# EAGLE design pwmMeterClock (EAGLE 5.10)
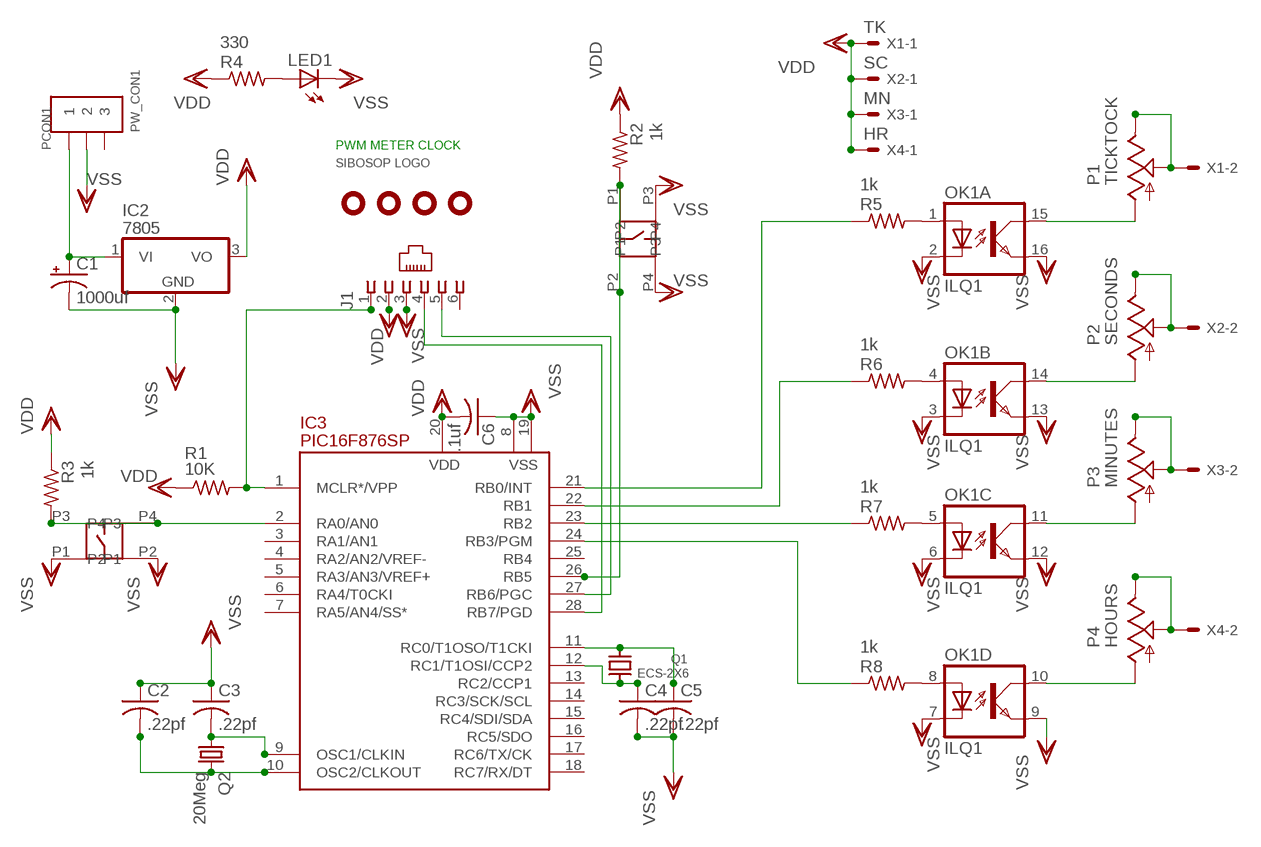
[diagram p0: schematic, sheet 1]

## Parts
C1  1000uf  CPOL-USE3.5-10  [E3,5-10]
C2  .22pf  C-US025-024X044  [C025-024X044]
C3  .22pf  C-US025-024X044  [C025-024X044]
C4  .22pf  C-US025-024X044  [C025-024X044]
C5  .22pf  C-US025-024X044  [C025-024X044]
C6  .1uf  C-US025-024X044  [C025-024X044]
IC2  7805  [TO220V]
IC3  PIC16F876SP  [DIL28-3]
J1  520250-3  [520250-3]
LED1  LEDSQR2X5  [LED2X5]
OK1  ILQ1  [DIL16]
P1  TICKTOCK  TRIMPOT  [RJ6S]
P2  SECONDS  TRIMPOT  [RJ6S]
P3  MINUTES  TRIMPOT  [RJ6S]
P4  HOURS  TRIMPOT  [RJ6S]
PCON1  PW_CON1  [PW_CON1]
Q1  ECS-2X6  [RADIAL-CRYSTAL-2.1MM]
Q2  20Meg  CRYSTALHC49S  [HC49/S]
R1  10K  R-US_0204/2V  [0204V]
R2  1k  R-US_0204/2V  [0204V]
R3  1k  R-US_0204/2V  [0204V]
R4  330  R-US_0204/2V  [0204V]
R5  1k  R-US_0204/2V  [0204V]
R6  1k  R-US_0204/2V  [0204V]
R7  1k  R-US_0204/2V  [0204V]
R8  1k  R-US_0204/2V  [0204V]
SW1  Hour  SW-B3W-1052  [SW-B3W-1052]
SW2  SW-B3W-1052  [SW-B3W-1052]
U$1  HOLE-125  [HOLE-125]
U$2  HOLE-125  [HOLE-125]
U$3  LOGO  [LOGO]
U$5  HOLE-125  [HOLE-125]
U$6  HOLE-125  [HOLE-125]
X1  TK  22-23-2021  [22-23-2021]
X2  SC  22-23-2021  [22-23-2021]
X3  MN  22-23-2021  [22-23-2021]
X4  HR  22-23-2021  [22-23-2021]

## Nets
N$1: IC3.1(MCLR*/VPP) J1.1 R1.2
N$2: C1.+ IC2.1(VI) PCON1.P$1
N$3: C2.2 IC3.10(OSC2/CLKOUT) Q2.2
N$4: C3.2 IC3.9(OSC1/CLKIN) Q2.1
N$5: P1.E P1.S X1.2
N$6: C5.1 IC3.11(RC0/T1OSO/T1CKI) Q1.1
N$7: C4.1 IC3.12(RC1/T1OSI/CCP2) Q1.2
N$8: P2.E P2.S X2.2
N$9: P3.E P3.S X3.2
N$10: P4.E P4.S X4.2
N$11: OK1.15(A:COL) P1.A
N$12: IC3.2(RA0/AN0) R3.2 SW1.P3 SW1.P4
N$13: IC3.26(RB5) R2.2 SW2.P1 SW2.P2
N$14: IC3.27(RB6/PGC) J1.5
N$15: OK1.14(B:COL) P2.A
N$16: OK1.11(C:COL) P3.A
N$17: OK1.10(D:COL) P4.A
N$18: IC3.28(RB7/PGD) J1.4
N$19: OK1.1(A:A) R5.2
N$20: OK1.4(B:A) R6.2
N$21: OK1.5(C:A) R7.2
N$22: LED1.A R4.2
N$23: OK1.8(D:A) R8.2
N$24: IC3.21(RB0/INT) R5.1
N$25: IC3.22(RB1) R6.1
N$26: IC3.23(RB2) R7.1
N$27: IC3.24(RB3/PGM) R8.1
VDD: C6.2 IC2.3(VO) IC3.20(VDD) J1.2 R1.1 R2.1 R3.1 R4.1 X1.1 X2.1 X3.1 X4.1
VSS: C1.- C2.1 C3.1 C4.2 C5.2 C6.1 IC2.2(GND) IC3.8(VSS) IC3.19(VSS) J1.3 LED1.K(C) OK1.2(A:C) OK1.3(B:C) OK1.6(C:C) OK1.7(D:C) OK1.9(D:EMIT) OK1.12(C:EMIT) OK1.13(B:EMIT) OK1.16(A:EMIT) PCON1.P$2 SW1.P1 SW1.P2 SW2.P3 SW2.P4
Unconnected: IC3.3(RA1/AN1) IC3.4(RA2/AN2/VREF-) IC3.5(RA3/AN3/VREF+) IC3.6(RA4/T0CKI) IC3.7(RA5/AN4/SS*) IC3.13(RC2/CCP1) IC3.14(RC3/SCK/SCL) IC3.15(RC4/SDI/SDA) IC3.16(RC5/SDO) IC3.17(RC6/TX/CK) IC3.18(RC7/RX/DT) IC3.25(RB4) J1.6 PCON1.P$3

## Notes on the sheet
- PWM METER CLOCK

## Library data of the parts
C1 = rcl:CPOL-US: POLARIZED CAPACITOR, American symbol
C2-C6 = rcl:C-US: CAPACITOR, American symbol
IC2 = kmarx1:78*: 78xx Family - Positive voltage regulator
IC3 = pic16f87x:PIC16F876: FLASH MICROCONTROLLER
J1 = con-amp:520250-3: AMP connector
LED1 = led:LED: LED OSRAM: - CHIPLED LG R971, LG N971, LY N971, LG Q971, LY Q971, LO R971, LY R971 LH N974, LH R974 LS Q976, LO Q976, LY Q976 LO Q996 - Hyper CHIPLED LW Q18S LB Q993, LB Q99A, LB R99A - SideLED LS A670, LO A670, LY A670, LG A670, LP A670 LB A673, LV A673, LT A673, LW A673 LH A674 LY A675 LS A676, LA A676, LO A676, LY A676, LW A676 LS A679, LY A679, LG A679 - Hyper Micro SIDELED® LS Y876, LA Y876, LO Y876, LY Y876 LT Y87S - SmartLED LW L88C, LW L88S LB L89C, LB L89S, LG L890 LS L89K, LO L89K, LY L89K LS L896, LA L896, LO L896, LY L896 - TOPLED LS T670, LO T670, LY T670, LG T670, LP T670 LSG T670, LSP T670, LSY T670, LOP T670, LYG T670 LG T671, LOG T671, LSG T671 LB T673, LV T673, LT T673, LW T673 LH T674 LS T676, LA T676, LO T676, LY T676, LB T676, LH T676, LSB T676, LW T676 LB T67C, LV T67C, LT T67C, LS T67K, LO T67K, LY T67K, LW E67C LS E67B, LA E67B, LO E67B, LY E67B, LB E67C, LV E67C, LT E67C LW T67C LS T679, LY T679, LG T679 LS T770, LO T770, LY T770, LG T770, LP T770 LB T773, LV T773, LT T773, LW T773 LH T774 LS E675, LA E675, LY E675, LS T675 LS T776, LA T776, LO T776, LY T776, LB T776 LHGB T686 LT T68C, LB T68C - Hyper Mini TOPLED® LB M676 - Mini TOPLED Santana® LG M470 LS M47K, LO M47K, LY M47K Source: http://www.osram.convergy.de LUXEON: - LUMILED® LXK2-PW12-R00, LXK2-PW12-S00, LXK2-PW14-U00, LXK2-PW14-V00 LXK2-PM12-R00, LXK2-PM12-S00, LXK2-PM14-U00 LXK2-PE12-Q00, LXK2-PE12-R00, LXK2-PE12-S00, LXK2-PE14-T00, LXK2-PE14-U00 LXK2-PB12-K00, LXK2-PB12-L00, LXK2-PB12-M00, LXK2-PB14-N00, LXK2-PB14-P00, LXK2-PB14-Q00 LXK2-PR12-L00, LXK2-PR12-M00, LXK2-PR14-Q00, LXK2-PR14-R00 LXK2-PD12-Q00, LXK2-PD12-R00, LXK2-PD12-S00 LXK2-PH12-R00, LXK2-PH12-S00 LXK2-PL12-P00, LXK2-PL12-Q00, LXK2-PL12-R00 Source: www.luxeon.com KINGBRIGHT: KA-3528ASYC Source: www.kingbright.com
OK1 = optocoupler:ILQ1: SIEMENS OPTO COUPLER
P1-P4 = sibosop:TRIMPOT
PCON1 = powerconnectorskt:PW_CON1
Q1 = kmarx1:ECS-2X6: ECS 2x6 32khz Tuning Fork Crystal ECS-.327-12.5-13 digikey X802-ND
Q2 = crystal:CRYSTAL: CRYSTAL
R1-R8 = rcl:R-US_: RESISTOR, American symbol
SW1 SW2 = sibosop:SW-B3W-1052
U$1 U$2 U$5 U$6 = sibosop:HOLE-125
U$3 = sibosop:LOGO
X1-X4 = sibosop-con-molex:22-23-2021: .100" (2.54mm) Center Header - 2 Pin

## Board
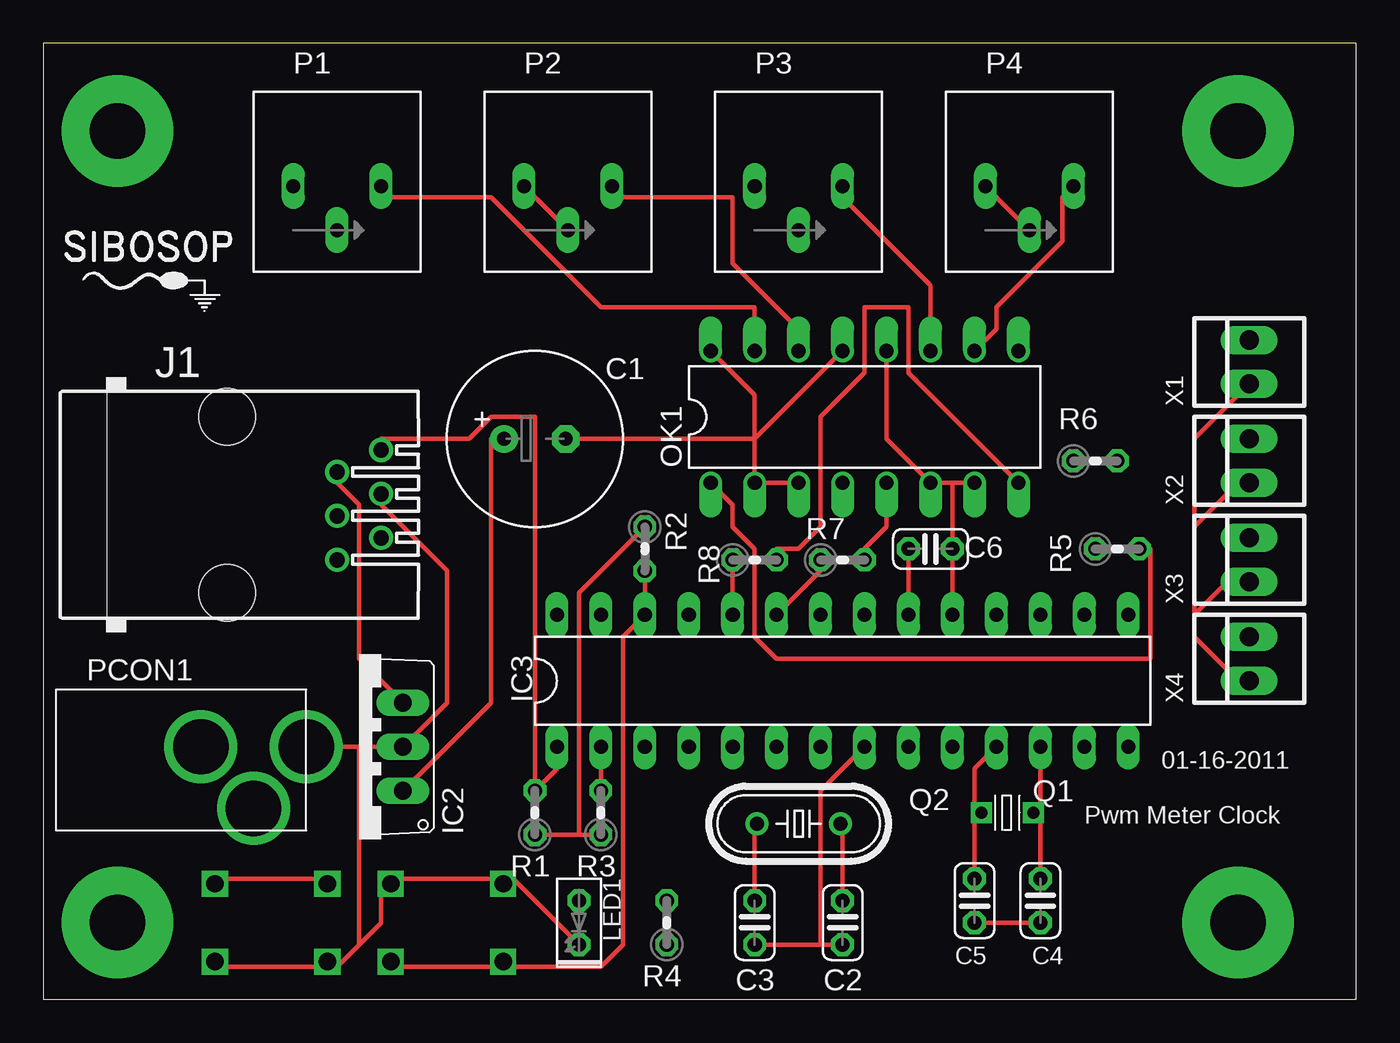
[diagram p1: board, top side]
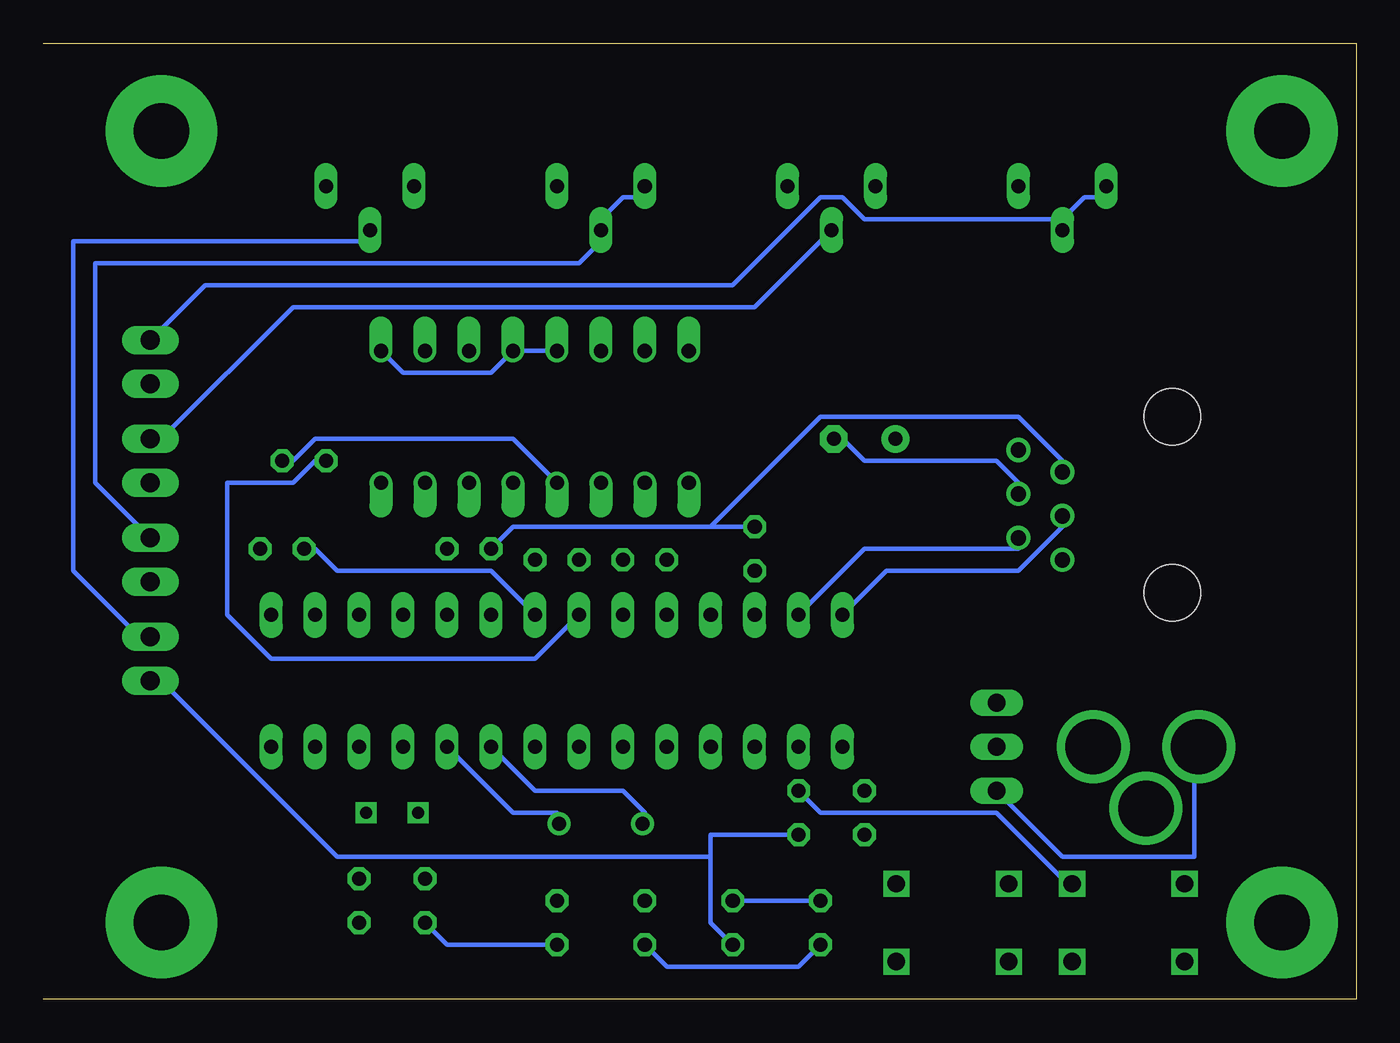
[diagram p2: board, bottom side, seen from below]

Size 75.87 x 55.23 mm. Coordinates in mm from the lower left corner, seen from the top.
Outline: 75.87,0 0,0 0,55.23 75.87,55.23
Copper layers (1*16): Top 0.035mm / dielectric 1.5mm / Bottom 0.035mm
Design rules "default": minimum track width 10mil, minimum drill 24mil, track to track 8mil, track to pad 8mil, pad to pad 8mil, via to via 8mil, smd to smd 8mil, copper to edge 40mil, drill to drill 8mil, minimum pad ring 10mil, minimum via ring 8mil, stop-mask expansion 4mil, vias tented up to drill 0mil, thermal gap 10mil

### Footprints (pad centres in the part's own frame; a part is rotated, then mirrored left to right if it is on the bottom)
E3,5-10 = drill 0.813 pad 1.6 round: + -1.778,0 | drill 0.813 pad 1.6 octagon: - 1.778,0
C025-024X044 = drill 0.813 octagon: 1 -1.27,0; 2 1.27,0
TO220V = drill 1.016 long: 1 -2.54,0; 2 0,0; 3 2.54,0
DIL28-3 = drill 0.813 long: 1 -16.51,-3.81; 2 -13.97,-3.81; 3 -11.43,-3.81; 4 -8.89,-3.81; 5 -6.35,-3.81; 6 -3.81,-3.81; 7 -1.27,-3.81; 8 1.27,-3.81; 9 3.81,-3.81; 10 6.35,-3.81; 11 8.89,-3.81; 12 11.43,-3.81; 13 13.97,-3.81; 14 16.51,-3.81; 15 16.51,3.81; 16 13.97,3.81; 17 11.43,3.81; 18 8.89,3.81; 19 6.35,3.81; 20 3.81,3.81; 21 1.27,3.81; 22 -1.27,3.81; 23 -3.81,3.81; 24 -6.35,3.81; 25 -8.89,3.81; 26 -11.43,3.81; 27 -13.97,3.81; 28 -16.51,3.81
520250-3 = drill 0.889 round: 1 -3.175,8.89; 2 -1.905,6.35; 3 -0.635,8.89; 4 0.635,6.35; 5 1.905,8.89; 6 3.175,6.35 | hole 3.251: -5.08,0; 5.08,0
LED2X5 = drill 0.813 octagon: A -1.27,0; K 1.27,0
DIL16 = drill 0.813 offset: 1 -8.89,-3.81; 2 -6.35,-3.81; 3 -3.81,-3.81; 4 -1.27,-3.81; 5 1.27,-3.81; 6 3.81,-3.81; 7 6.35,-3.81; 8 8.89,-3.81; 9 8.89,3.81; 10 6.35,3.81; 11 3.81,3.81; 12 1.27,3.81; 13 -1.27,3.81; 14 -3.81,3.81; 15 -6.35,3.81; 16 -8.89,3.81
RJ6S = drill 0.813 long: A 2.54,0; E -2.54,0; S 0,-2.54
PW_CON1 = drill 3.2 pad 3.81 round: P$1 -0.254,0; P$2 5.842,0; P$3 2.794,-3.556
RADIAL-CRYSTAL-2.1MM = drill 0.7 square: 1 0,1.5; 2 0,-1.5
HC49/S = drill 0.813 round: 1 -2.413,0; 2 2.413,0
0204V = drill 0.813 octagon: 1 -1.27,0; 2 1.27,0
SW-B3W-1052 = drill 1 square: P1 3.25,-2.25; P2 -3.25,-2.25; P3 3.25,2.25; P4 -3.25,2.25
HOLE-125 = drill 3.2 pad 6.452 round: P$1 0,0
22-23-2021 = drill 1.1 long: 1 -1.27,0; 2 1.27,0

### Placement (x,y rotation side)
C1  28.41,32.38 0 top
C2  46.19,4.44 90 top
C3  41.11,4.44 90 top
C4  57.62,5.71 270 top
C5  53.81,5.71 270 top
C6  51.27,26.03 180 top
IC2  20.79,14.6 90 top
IC3  46.19,18.41 0 top
J1  10.63,28.57 270 top
LED1  30.95,4.44 270 top
OK1  47.46,33.65 0 top
P1  16.98,46.98 0 top
P2  30.31,46.98 0 top
P3  43.65,46.98 0 top
P4  56.98,46.98 0 top
PCON1  9.36,14.6 0 top
Q1  55.71,10.79 90 top
Q2  43.65,10.16 0 top
R1  28.41,10.79 90 top
R2  34.76,26.03 270 top
R3  32.22,10.79 90 top
R4  36.03,4.44 90 top
R5  62.06,26.03 0 top
R6  60.8,31.11 0 top
R7  46.19,25.39 0 top
R8  41.11,25.39 0 top
SW1  13.17,4.44 0 top
SW2  23.33,4.44 0 top
U$1  4.28,4.44 0 top
U$2  69.05,4.44 0 top
U$3  5.55,43.18 0 top
U$5  69.05,50.16 0 top
U$6  4.28,50.16 0 top
X1  69.69,36.83 90 top
X2  69.69,31.11 90 top
X3  69.69,25.39 90 top
X4  69.69,19.68 90 top

### Tracks (layer width: path | path; a pad name or v marks a point on that pad's centre or on a via)
N$1
  Top 0.254: IC3.1 29.68,13.33 R1.2 28.41,33.65 25.87,33.65 24.6,32.38 19.52,32.38 J1.1
N$2
  Top 0.254: IC2.1 25.87,17.14 25.87,32.38 C1.+
  Bottom 0.254: IC2.1 16.98,8.25 9.36,8.25 9.36,14.6 PCON1.P$1
N$3
  Top 0.254: C2.2 46.19,9.52 Q2.2
  Bottom 0.254: IC3.10 48.73,10.79 46.19,10.79 Q2.2
N$4
  Top 0.254: C3.2 41.11,9.52 Q2.1
  Bottom 0.254: IC3.9 47.46,12.06 42.38,12.06 41.11,10.79 Q2.1
N$5
  Bottom 0.254: 16.98,45.08 15.71,46.35 14.44,46.35 P1.E | 16.98,45.08 28.41,45.08 29.68,46.35 30.95,46.35 36.03,41.27 66.51,41.27 X1.2 | P1.S 16.98,45.08
N$6
  Top 0.254: C5.1 53.81,10.79 | IC3.11 53.81,13.33 53.81,10.79 | 53.81,10.79 Q1.1
N$7
  Top 0.254: 57.62,10.79 IC3.12 | C4.1 57.62,10.79 | 57.62,10.79 Q1.2
N$8
  Top 0.254: P2.S P2.E
  Bottom 0.254: X2.2 69.05,32.38 61.43,40 34.76,40 P2.S
N$9
  Bottom 0.254: P3.E 41.11,46.35 42.38,46.35 43.65,45.08 P3.S 43.65,43.81 44.92,42.54 72.86,42.54 72.86,29.84 X3.2
N$10
  Top 0.254: P4.S P4.E
  Bottom 0.254: X4.2 70.32,20.95 74.13,24.76 74.13,43.81 57.62,43.81 P4.S
N$11
  Top 0.254: OK1.15 41.11,40 32.22,40 25.87,46.35 19.52,46.35 P1.A
N$12
  Top 0.254: R3.2 IC3.2 | SW1.P4 10.63,6.98 15.71,6.98 SW1.P3
  Bottom 0.254: R3.2 30.95,10.79 20.79,10.79 16.98,6.98 SW1.P3
N$13
  Top 0.254: R2.2 IC3.26 33.49,20.95 33.49,3.17 32.22,1.9 27.14,1.9 SW2.P1 25.87,1.9 20.79,1.9 SW2.P2
N$14
  Bottom 0.254: IC3.27 28.41,26.03 19.52,26.03 J1.5
N$15
  Top 0.254: OK1.14 43.65,38.73 39.84,42.54 39.84,46.35 33.49,46.35 P2.A
N$16
  Top 0.254: OK1.11 51.27,41.27 46.19,46.35 P3.A
N$17
  Top 0.254: OK1.10 55.08,38.73 55.08,40 58.89,43.81 58.89,46.35 P4.A
N$18
  Bottom 0.254: IC3.28 27.14,24.76 19.52,24.76 16.98,27.3 J1.4
N$19
  Top 0.254: OK1.1 39.84,28.57 39.84,27.3 41.11,26.03 41.11,20.95 42.38,19.68 63.97,19.68 63.97,26.03 R5.2
N$20
  Bottom 0.254: OK1.4 48.73,32.38 60.16,32.38 61.43,31.11 R6.2
N$21
  Top 0.254: OK1.5 48.73,27.3 47.46,26.03 R7.2
N$22
  Bottom 0.254: LED1.A R4.2
N$23
  Top 0.254: OK1.8 50,36.19 50,40 47.46,40 47.46,36.19 44.92,33.65 44.92,27.3 43.65,26.03 42.38,26.03 R8.2
N$24
  Bottom 0.254: IC3.21 50,24.76 58.89,24.76 60.16,26.03 R5.1
N$25
  Bottom 0.254: IC3.22 47.46,19.68 62.7,19.68 65.24,22.22 65.24,29.84 61.43,29.84 60.16,31.11 R6.1
N$26
  Top 0.254: IC3.23 44.92,24.76 R7.1
N$27
  Top 0.254: IC3.24 R8.1
VDD
  Top 0.254: 66.51,22.22 66.51,20.95 69.05,18.41 X4.1 | 66.51,22.22 69.05,24.76 X3.1 | 66.51,27.3 69.05,29.84 X2.1 | 66.51,22.22 66.51,27.3 | 66.51,27.3 66.51,32.38 X1.1 | IC2.3 18.25,19.68 18.25,28.57 16.98,29.84 J1.2 | C6.2 IC3.20 | 30.95,9.52 R3.1 | R1.1 30.95,9.52 | R2.1 30.95,23.49 30.95,9.52
  Bottom 0.254: R4.1 37.3,4.44 37.3,8.25 | 37.3,8.25 37.3,9.52 R3.1 | C6.2 48.73,27.3 37.3,27.3 | R2.1 37.3,27.3 | 37.3,27.3 30.95,33.65 19.52,33.65 16.98,31.11 J1.2 | 37.3,8.25 58.89,8.25 69.05,18.41 X4.1
VSS
  Top 0.254: 52.54,29.84 OK1.7 | 52.54,29.84 OK1.6 48.73,32.38 OK1.12 | IC3.19 C6.1 52.54,29.84 | OK1.3 OK1.2 41.11,32.38 | OK1.16 41.11,34.92 41.11,32.38 | 41.11,32.38 OK1.13 | C1.- 41.11,32.38 | C5.2 C4.2 | 44.92,3.17 C2.1 | C3.1 44.92,3.17 | IC3.8 44.92,12.06 44.92,3.17 | 18.25,14.6 IC2.2 23.33,17.14 23.33,24.76 19.52,28.57 J1.3 | 18.25,14.6 PCON1.P$2 | SW1.P2 10.63,1.9 15.71,1.9 SW1.P1 16.98,1.9 18.25,3.17 | LED1.K 27.14,6.98 SW2.P3 25.87,6.98 20.79,6.98 SW2.P4 19.52,6.98 19.52,4.44 18.25,3.17 | 18.25,3.17 18.25,14.6
  Bottom 0.254: J1.3 19.52,29.84 20.79,31.11 28.41,31.11 29.68,32.38 C1.- | OK1.13 OK1.12 50,36.19 55.08,36.19 OK1.9 | C5.2 52.54,3.17 C2.1 | C3.1 39.84,1.9 32.22,1.9 LED1.K

### Text on the board
tNames: 01-16-2011 | Pwm Meter Clock